# EAGLE design adapter (EAGLE 7.2.0)
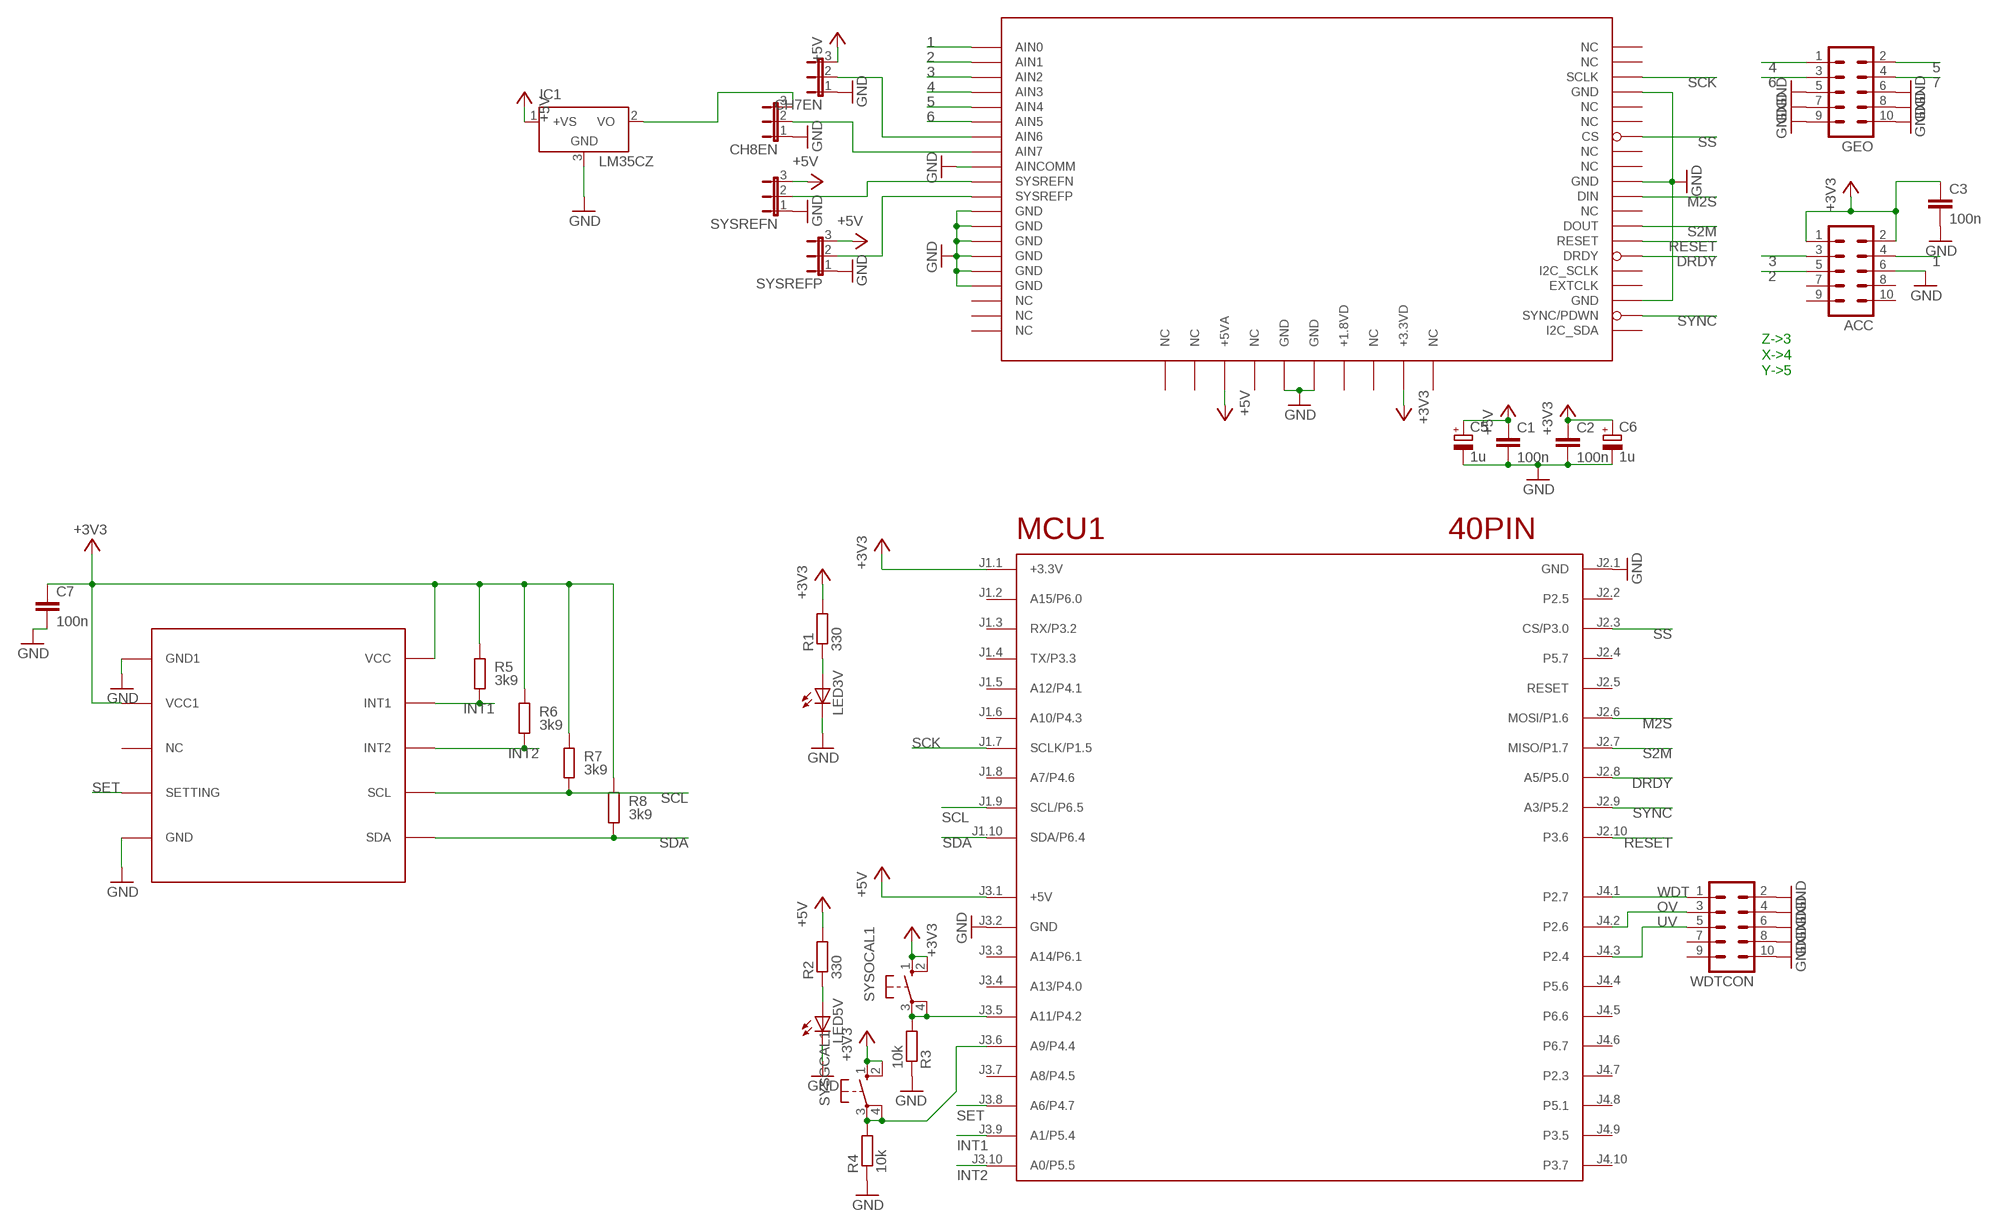
[diagram p0: schematic, sheet 1]

## Parts
ACC  ML10  [ML10]
C1  100n  C-EU050-025X075  [C050-025X075]
C2  100n  C-EU050-025X075  [C050-025X075]
C3  100n  C-EU050-025X075  [C050-025X075]
C5  1u  CPOL-EUE2,5-6E  [E2,5-6E]
C6  1u  CPOL-EUE2,5-6E  [E2,5-6E]
C7  100n  C-EU050-025X075  [C050-025X075]
CH7EN  JP2E  [JP2]
CH8EN  JP2E  [JP2]
GEO  ML10  [ML10]
IC1  LM35CZ  [TO92]
LED3V  LED3MM  [LED3MM]
LED5V  LED3MM  [LED3MM]
MCU1  40PIN  [40PIN]
R1  330  R-EU_0207/10  [0207/10]
R2  330  R-EU_0207/10  [0207/10]
R3  10k  R-EU_0207/10  [0207/10]
R4  10k  R-EU_0207/10  [0207/10]
R5  3k9  R-EU_0207/10  [0207/10]
R6  3k9  R-EU_0207/10  [0207/10]
R7  3k9  R-EU_0207/10  [0207/10]
R8  3k9  R-EU_0207/10  [0207/10]
SYSGCAL1  10-XX  [B3F-10XX]
SYSOCAL1  10-XX  [B3F-10XX]
SYSREFN  JP2E  [JP2]
SYSREFP  JP2E  [JP2]
U$1  D7S  [D7S]
U$2  ADS1256EVM  [ADS1256EVM]
WDTCON  ML10  [ML10]

## Nets
1: ACC.4 U$2.J1.1(AIN0)
2: ACC.5 U$2.J1.2(AIN1)
3: ACC.3 U$2.J1.3(AIN2)
4: GEO.1 U$2.J1.4(AIN3)
5: GEO.2 U$2.J1.5(AIN4)
6: GEO.3 U$2.J1.6(AIN5)
7: GEO.4
+3V3 [power]: ACC.1 ACC.2 C2.1 C3.1 C6.+ C7.1 MCU1.J1.1(+3.3V) R1.2 R5.2 R6.2 R7.2 R8.2 SYSGCAL1.1(S) SYSGCAL1.2(S1) SYSOCAL1.1(S) SYSOCAL1.2(S1) U$1.P$1(VCC) U$1.P$9(VCC1) U$2.J3.9(+3.3VD)
+5V [power]: C1.1 C5.+ CH7EN.3 IC1.1(+VS) MCU1.J3.1(+5V) R2.2 SYSREFN.3 SYSREFP.3 U$2.J3.3(+5VA)
DRDY: MCU1.J2.8(A5/P5.0) U$2.J2.15(DRDY)
GND [power]: ACC.6 C1.2 C2.2 C3.2 C5.- C6.- C7.2 CH7EN.1 CH8EN.1 GEO.5 GEO.6 GEO.7 GEO.8 GEO.9 GEO.10 IC1.3(GND) LED3V.K(C) LED5V.K(C) MCU1.J2.1(GND) MCU1.J3.2(GND) R3.1 R4.1 SYSREFN.1 SYSREFP.1 U$1.P$6(GND) U$1.P$10(GND1) U$2.J1.9(GND) U$2.J1.10(AINCOMM) U$2.J1.11(GND) U$2.J1.13(GND) U$2.J1.15(GND) U$2.J1.17(GND) U$2.J1.19(GND) U$2.J2.4(GND) U$2.J2.10(GND) U$2.J2.18(GND) U$2.J3.5(GND) U$2.J3.6(GND) WDTCON.2 WDTCON.4 WDTCON.6 WDTCON.8 WDTCON.10
INT1: MCU1.J3.9(A1/P5.4) R5.1 U$1.P$2(INT1)
INT2: MCU1.J3.10(A0/P5.5) R6.1 U$1.P$3(INT2)
M2S: MCU1.J2.6(MOSI/P1.6) U$2.J2.11(DIN)
N$1: LED3V.A R1.1
N$2: LED5V.A R2.1
N$3: CH8EN.3 IC1.2(VO)
N$4: CH8EN.2 U$2.J1.8(AIN7)
N$5: CH7EN.2 U$2.J1.7(AIN6)
N$7: MCU1.J3.5(A11/P4.2) R3.2 SYSOCAL1.3(P) SYSOCAL1.4(P1)
N$8: MCU1.J3.6(A9/P4.4) R4.2 SYSGCAL1.3(P) SYSGCAL1.4(P1)
N$22: SYSREFN.2 U$2.J1.18(SYSREFN)
N$23: SYSREFP.2 U$2.J1.20(SYSREFP)
OV: MCU1.J4.2(P2.6) WDTCON.3
RESET: MCU1.J2.10(P3.6) U$2.J2.14(RESET)
S2M: MCU1.J2.7(MISO/P1.7) U$2.J2.13(DOUT)
SCK: MCU1.J1.7(SCLK/P1.5) U$2.J2.3(SCLK)
SCL: MCU1.J1.9(SCL/P6.5) R7.1 U$1.P$4(SCL)
SDA: MCU1.J1.10(SDA/P6.4) R8.1 U$1.P$5(SDA)
SET: MCU1.J3.8(A6/P4.7) U$1.P$7(SETTING)
SS: MCU1.J2.3(CS/P3.0) U$2.J2.7(CS)
SYNC: MCU1.J2.9(A3/P5.2) U$2.J2.19(SYNC/PDWN)
UV: MCU1.J4.3(P2.4) WDTCON.5
WDT: MCU1.J4.1(P2.7) WDTCON.1
Unconnected: ACC.7 ACC.8 ACC.9 ACC.10 MCU1.J1.2(A15/P6.0) MCU1.J1.3(RX/P3.2) MCU1.J1.4(TX/P3.3) MCU1.J1.5(A12/P4.1) MCU1.J1.6(A10/P4.3) MCU1.J1.8(A7/P4.6) MCU1.J2.2(P2.5) MCU1.J2.4(P5.7) MCU1.J2.5(RESET) MCU1.J3.3(A14/P6.1) MCU1.J3.4(A13/P4.0) MCU1.J3.7(A8/P4.5) MCU1.J4.4(P5.6) MCU1.J4.5(P6.6) MCU1.J4.6(P6.7) MCU1.J4.7(P2.3) MCU1.J4.8(P5.1) MCU1.J4.9(P3.5) MCU1.J4.10(P3.7) U$1.P$8(NC) U$2.J1.12(NC) U$2.J1.14(NC) U$2.J1.16(NC) U$2.J2.1(NC) U$2.J2.2(NC) U$2.J2.5(NC) U$2.J2.6(NC) U$2.J2.8(NC) U$2.J2.9(NC) U$2.J2.12(NC) U$2.J2.16(I2C_SCLK) U$2.J2.17(EXTCLK) U$2.J2.20(I2C_SDA) U$2.J3.1(NC) U$2.J3.2(NC) U$2.J3.4(NC) U$2.J3.7(+1.8VD) U$2.J3.8(NC) U$2.J3.10(NC) WDTCON.7 WDTCON.9

## Notes on the sheet
- Z->3
  X->4
  Y->5

## Library data of the parts
ACC GEO WDTCON = con-ml:ML10: HARTING; OC_FARNELL: unknown; OC_NEWARK: unknown
C1-C3 C7 = rcl:C-EU: CAPACITOR, European symbol
C5 C6 = rcl:CPOL-EU: POLARIZED CAPACITOR, European symbol
CH7EN CH8EN SYSREFN SYSREFP = jumper:JP2E: JUMPER
IC1 = lm35:LM35: Single-Supply Centigrade Temperature Sensor Vout = (10mV/°C x Temp °C) +5mmmV Source: http://www.national.com/ds/LM/LM35.pdf
LED3V LED5V = led:LED: LED OSRAM: - CHIPLED LG R971, LG N971, LY N971, LG Q971, LY Q971, LO R971, LY R971 LH N974, LH R974 LS Q976, LO Q976, LY Q976 LO Q996 - Hyper CHIPLED LW Q18S LB Q993, LB Q99A, LB R99A - SideLED LS A670, LO A670, LY A670, LG A670, LP A670 LB A673, LV A673, LT A673, LW A673 LH A674 LY A675 LS A676, LA A676, LO A676, LY A676, LW A676 LS A679, LY A679, LG A679 - Hyper Micro SIDELED® LS Y876, LA Y876, LO Y876, LY Y876 LT Y87S - SmartLED LW L88C, LW L88S LB L89C, LB L89S, LG L890 LS L89K, LO L89K, LY L89K LS L896, LA L896, LO L896, LY L896 - TOPLED LS T670, LO T670, LY T670, LG T670, LP T670 LSG T670, LSP T670, LSY T670, LOP T670, LYG T670 LG T671, LOG T671, LSG T671 LB T673, LV T673, LT T673, LW T673 LH T674 LS T676, LA T676, LO T676, LY T676, LB T676, LH T676, LSB T676, LW T676 LB T67C, LV T67C, LT T67C, LS T67K, LO T67K, LY T67K, LW E67C LS E67B, LA E67B, LO E67B, LY E67B, LB E67C, LV E67C, LT E67C LW T67C LS T679, LY T679, LG T679 LS T770, LO T770, LY T770, LG T770, LP T770 LB T773, LV T773, LT T773, LW T773 LH T774 LS E675, LA E675, LY E675, LS T675 LS T776, LA T776, LO T776, LY T776, LB T776 LHGB T686 LT T68C, LB T68C - Hyper Mini TOPLED® LB M676 - Mini TOPLED Santana® LG M470 LS M47K, LO M47K, LY M47K Source: http://www.osram.convergy.de LUXEON: - LUMILED® LXK2-PW12-R00, LXK2-PW12-S00, LXK2-PW14-U00, LXK2-PW14-V00 LXK2-PM12-R00, LXK2-PM12-S00, LXK2-PM14-U00 LXK2-PE12-Q00, LXK2-PE12-R00, LXK2-PE12-S00, LXK2-PE14-T00, LXK2-PE14-U00 LXK2-PB12-K00, LXK2-PB12-L00, LXK2-PB12-M00, LXK2-PB14-N00, LXK2-PB14-P00, LXK2-PB14-Q00 LXK2-PR12-L00, LXK2-PR12-M00, LXK2-PR14-Q00, LXK2-PR14-R00 LXK2-PD12-Q00, LXK2-PD12-R00, LXK2-PD12-S00 LXK2-PH12-R00, LXK2-PH12-S00 LXK2-PL12-P00, LXK2-PL12-Q00, LXK2-PL12-R00 Source: www.luxeon.com KINGBRIGHT: KA-3528ASYC Source: www.kingbright.com
MCU1 = msp432Launchpad:40PIN
R1-R4 = rcl:R-EU_: RESISTOR, European symbol
R5-R8 = resistor:R-EU_: RESISTOR, European symbol; TOLERANCE: 5%
SYSGCAL1 SYSOCAL1 = switch-omron:10-XX: OMRON SWITCH; MPN: B3F-1000; OC_FARNELL: 176432; OC_NEWARK: 36M3542
U$1 = e14_Rpi3_RevA:D7S
U$2 = TIStellarisLaunchpad:ADS1256EVM

## Net classes
1 power: width 0.406 mm, clearance 0.203 mm

## Board
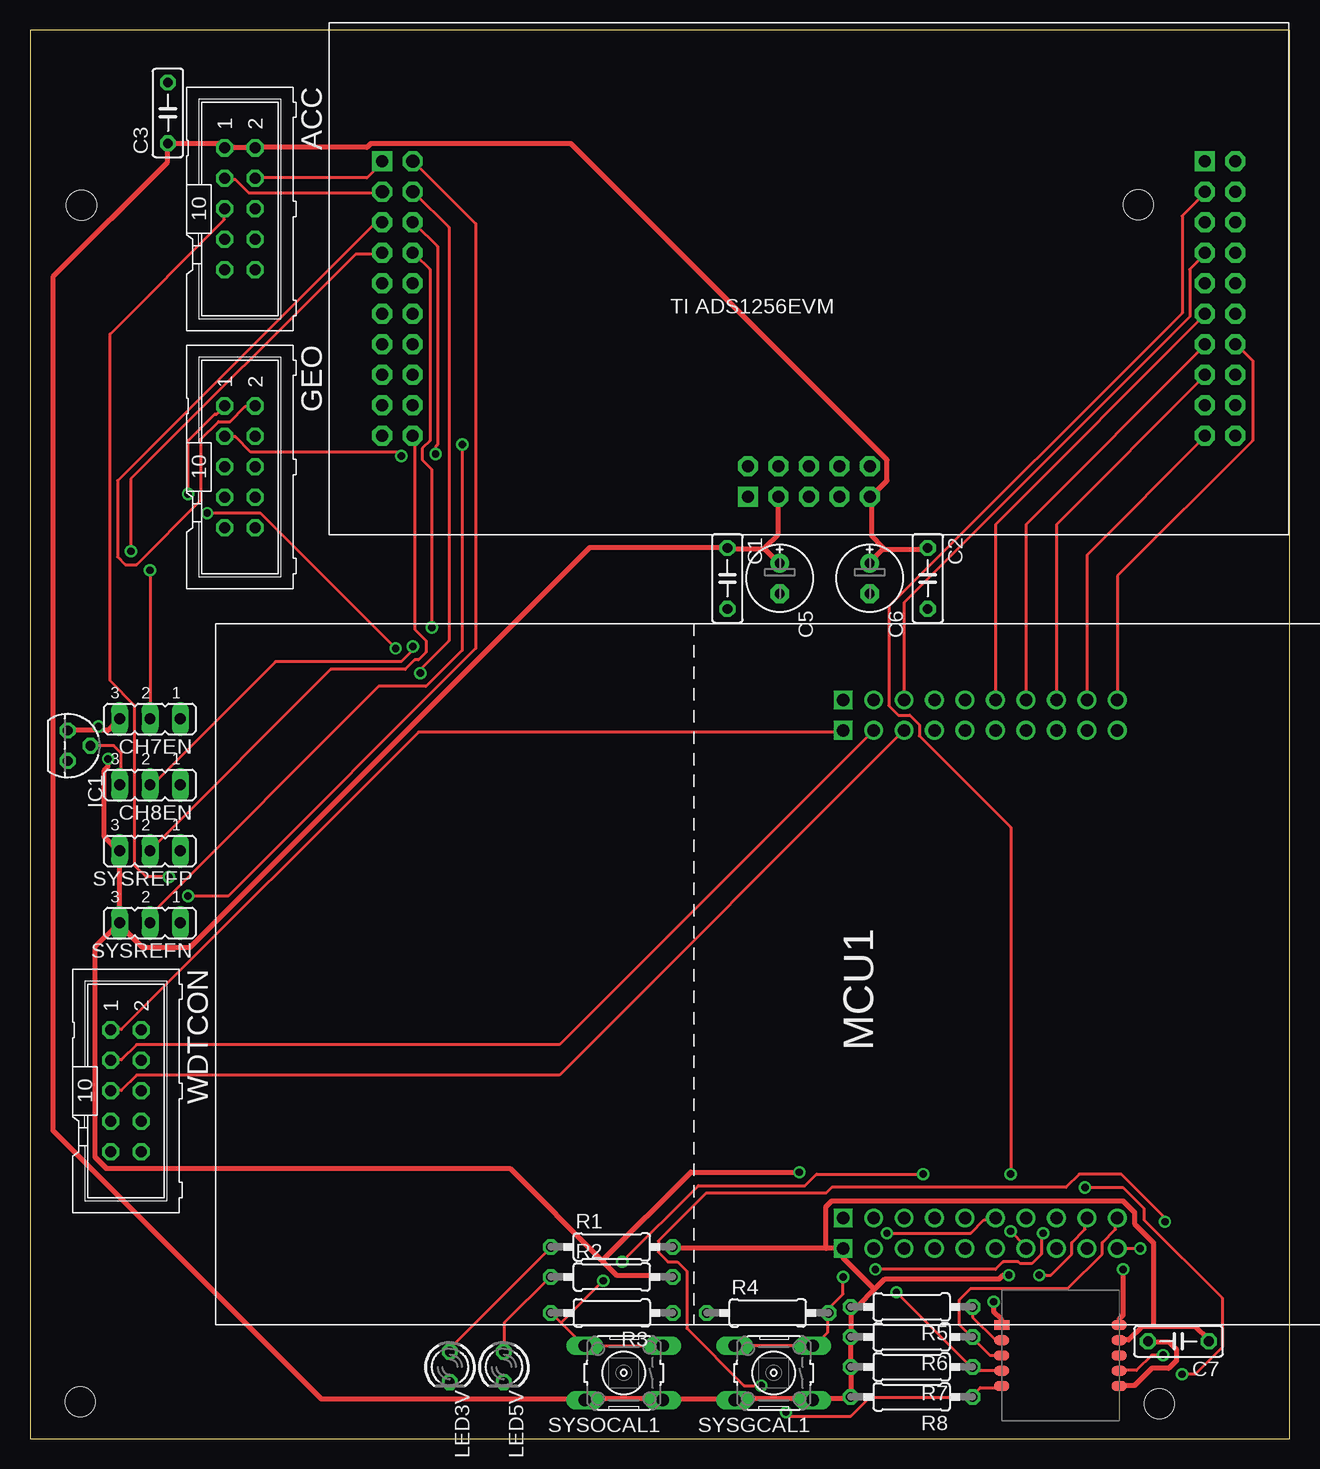
[diagram p1: board, top side]
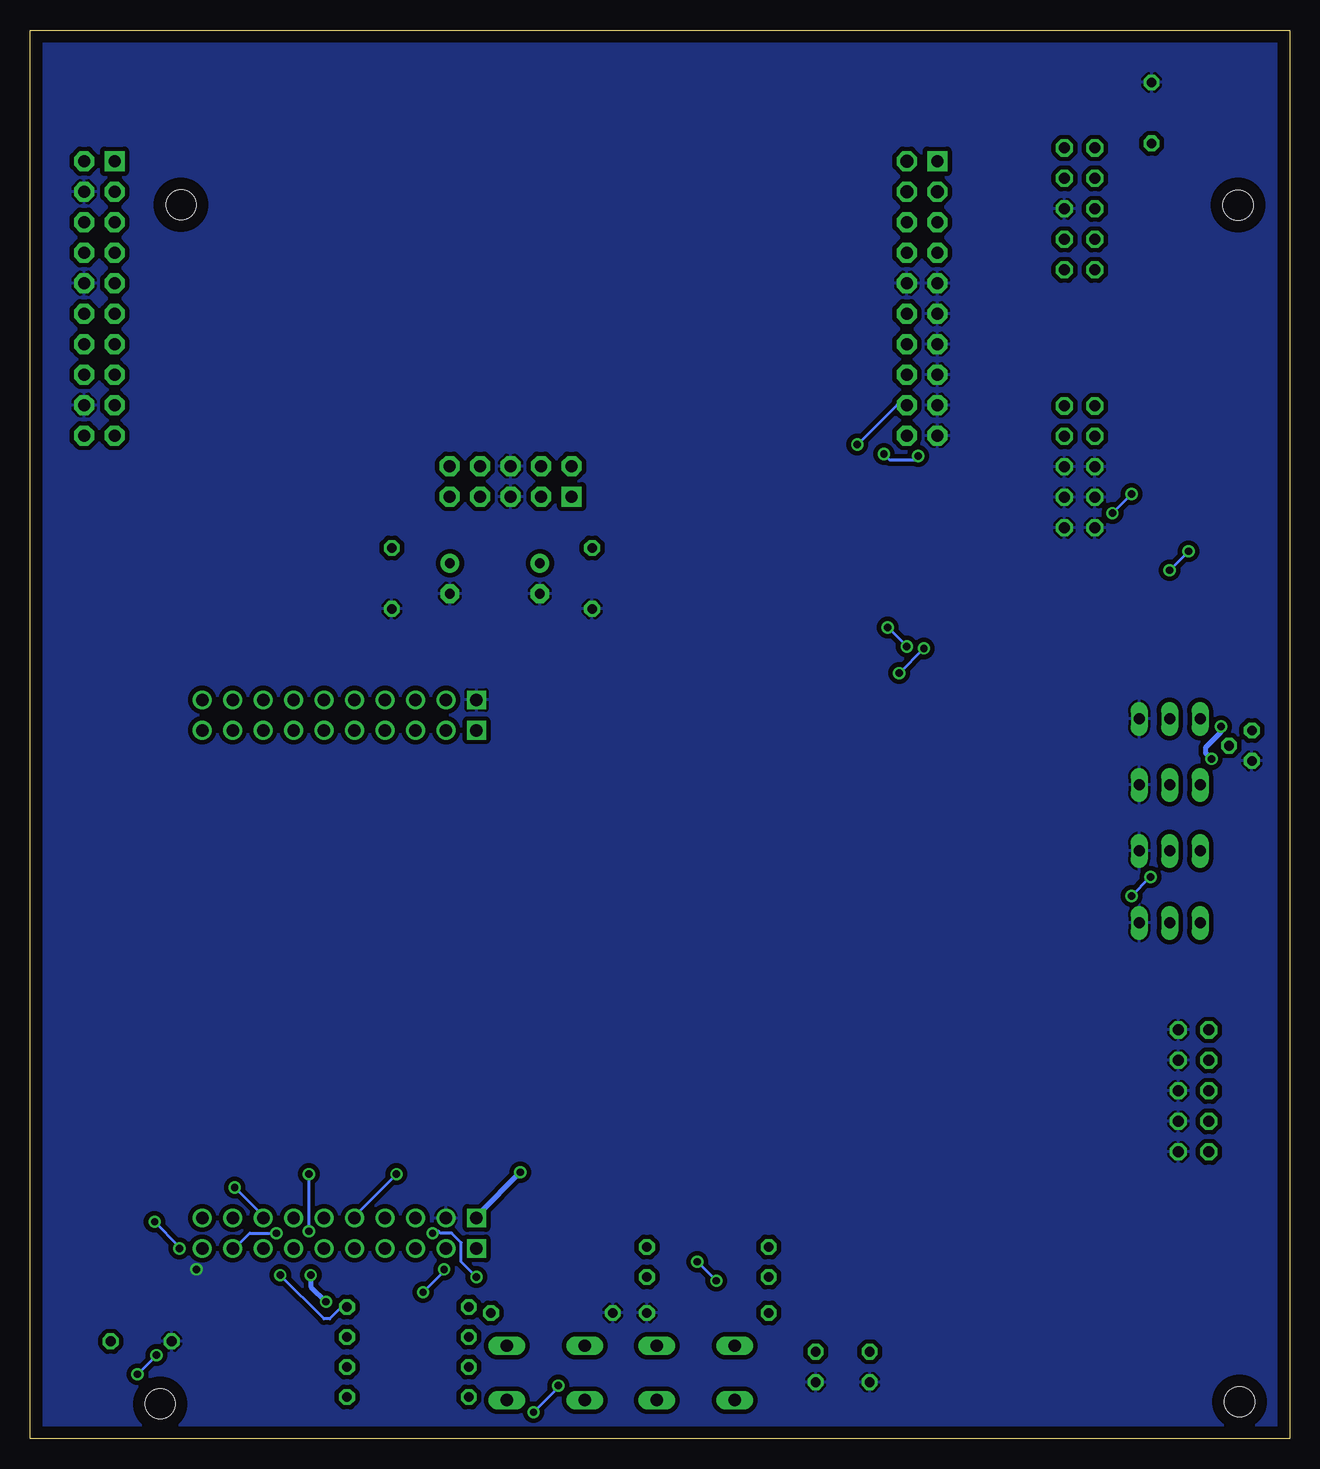
[diagram p2: board, bottom side, seen from below]

Size 105 x 117.41 mm. Coordinates in mm from the lower left corner, seen from the top.
Outline: 0,0 105,0 105,117.41 0,117.41 0,0
Copper layers (1*16): Top 0.035mm / dielectric 1.5mm / Bottom 0.035mm
Design rules "default *": minimum track width 10mil, minimum drill 24mil, track to track 15mil, track to pad 12mil, pad to pad 12mil, via to via 15mil, smd to smd 8mil, copper to edge 40mil, drill to drill 8mil, minimum pad ring 10mil, minimum via ring 8mil, stop-mask expansion 4mil, vias tented up to drill 0mil, thermal gap 8mil
Holes 2.5 mm at 4.18,3.1 92.41,102.84 94.15,2.92 4.29,102.82

### Footprints (pad centres in the part's own frame; a part is rotated, then mirrored left to right if it is on the bottom)
ML10 = drill 0.914 octagon: 1 -5.08,-1.27; 2 -5.08,1.27; 3 -2.54,-1.27; 4 -2.54,1.27; 5 0,-1.27; 6 0,1.27; 7 2.54,-1.27; 8 2.54,1.27; 9 5.08,-1.27; 10 5.08,1.27
C050-025X075 = drill 0.813 octagon: 1 -2.54,0; 2 2.54,0
E2,5-6E = drill 0.813 pad 1.575: + -1.27,0 | drill 0.813 pad 1.575 octagon: - 1.27,0
JP2 = drill 0.914 long: 1 -2.54,0; 2 0,0; 3 2.54,0
TO92 = drill 0.813 octagon: 1 -1.27,0; 2 0,1.905; 3 1.27,0
LED3MM = drill 0.813 octagon: A -1.27,0; K 1.27,0
40PIN = drill 1.041 square: J1.1 -10.16,-22.86; J2.1 -10.16,22.86; J3.1 -10.16,-20.32; J4.1 -10.16,20.32 | drill 1.041: J1.2 -7.62,-22.86; J1.3 -5.08,-22.86; J1.4 -2.54,-22.86; J1.5 0,-22.86; J1.6 2.54,-22.86; J1.7 5.08,-22.86; J1.8 7.62,-22.86; J1.9 10.16,-22.86; J1.10 12.7,-22.86; J2.2 -7.62,22.86; J2.3 -5.08,22.86; J2.4 -2.54,22.86; J2.5 0,22.86; J2.6 2.54,22.86; J2.7 5.08,22.86; J2.8 7.62,22.86; J2.9 10.16,22.86; J2.10 12.7,22.86; J3.2 -7.62,-20.32; J3.3 -5.08,-20.32; J3.4 -2.54,-20.32; J3.5 0,-20.32; J3.6 2.54,-20.32; J3.7 5.08,-20.32; J3.8 7.62,-20.32; J3.9 10.16,-20.32; J3.10 12.7,-20.32; J4.2 -7.62,20.32; J4.3 -5.08,20.32; J4.4 -2.54,20.32; J4.5 0,20.32; J4.6 2.54,20.32; J4.7 5.08,20.32; J4.8 7.62,20.32; J4.9 10.16,20.32; J4.10 12.7,20.32
0207/10 = drill 0.813 octagon: 1 -5.08,0; 2 5.08,0
B3F-10XX = drill 1.016 long: 1 -3.251,2.261; 2 3.251,2.261; 3 -3.251,-2.261; 4 3.251,-2.261
D7S = smd 1.25 x 0.8: P$1 0,7.99; P$2 0,6.72; P$3 0,5.45; P$4 0,4.18; P$5 0,2.91; P$6 9.8,2.91; P$7 9.8,4.18; P$8 9.8,5.45; P$9 9.8,6.72; P$10 9.8,7.99
ADS1256EVM = drill 1 pad 1.676 square: J1.1 -24.13,13.97; J2.1 44.45,13.97; J3.1 6.35,-13.97 | drill 1.1 pad 1.676 octagon: J1.2 -21.59,13.97; J1.3 -24.13,11.43; J1.4 -21.59,11.43 | drill 1 pad 1.676 octagon: J1.5 -24.13,8.89; J1.6 -21.59,8.89; J1.7 -24.13,6.35; J1.8 -21.59,6.35; J1.9 -24.13,3.81; J1.10 -21.59,3.81; J1.11 -24.13,1.27; J1.12 -21.59,1.27; J1.13 -24.13,-1.27; J1.14 -21.59,-1.27; J1.15 -24.13,-3.81; J1.16 -21.59,-3.81; J1.17 -24.13,-6.35; J1.18 -21.59,-6.35; J1.19 -24.13,-8.89; J1.20 -21.59,-8.89; J2.2 46.99,13.97; J2.3 44.45,11.43; J2.4 46.99,11.43; J2.5 44.45,8.89; J2.6 46.99,8.89; J2.7 44.45,6.35; J2.8 46.99,6.35; J2.9 44.45,3.81; J2.10 46.99,3.81; J2.11 44.45,1.27; J2.12 46.99,1.27; J2.13 44.45,-1.27; J2.14 46.99,-1.27; J2.15 44.45,-3.81; J2.16 46.99,-3.81; J2.17 44.45,-6.35; J2.18 46.99,-6.35; J2.19 44.45,-8.89; J2.20 46.99,-8.89; J3.2 6.35,-11.43; J3.3 8.89,-13.97; J3.4 8.89,-11.43; J3.5 11.43,-13.97; J3.6 11.43,-11.43; J3.7 13.97,-13.97; J3.8 13.97,-11.43; J3.9 16.51,-13.97; J3.10 16.51,-11.43

### Placement (x,y rotation side)
ACC  17.5,102.5 270 top
C1  58.14,71.71 270 top
C2  74.84,71.71 270 top
C3  11.5,110.5 90 top
C5  62.5,71.71 270 top
C6  70,71.71 270 top
C7  95.74,8.13 180 top
CH7EN  10,60 180 top
CH8EN  10,54.5 180 top
GEO  17.5,81 270 top
IC1  3.14,57.77 270 top
LED3V  35,6 270 top
LED5V  39.5,6 270 top
MCU1  77.94,38.73 0 top
R1  48.5,16 0 top
R2  48.5,13.5 0 top
R3  48.5,10.5 180 top
R4  61.5,10.5 0 top
R5  73.5,11 180 top
R6  73.5,8.5 180 top
R7  73.5,6 180 top
R8  73.5,3.5 180 top
SYSGCAL1  62,5.5 180 top
SYSOCAL1  49.5,5.5 180 top
SYSREFN  10,43 180 top
SYSREFP  10,49 180 top
U$1  81,1.5 0 top
U$2  53.5,92.5 0 top
WDTCON  8,29 270 top

### Tracks (layer width: path | path; a pad name or v marks a point on that pad's centre or on a via)
1
  Top 0.254: ACC.4 18.89,105.09 28.1,105.09 29.37,106.36 U$2.J1.1
2  (via drill 0.61)
  Top 0.254: v11.59,46.83 9.68,46.83 8.73,47.78 8.73,61.12 6.67,63.18 6.67,92.08 16.19,101.6 16.19,102.39 ACC.5 | v13.18,45.24 16.51,45.24 37.15,65.88 37.15,101.28 32.07,106.36 U$2.J1.2
  Bottom 0.254: v13.18,45.24 v11.59,46.83
3
  Top 0.254: ACC.3 16.35,104.93 17.14,104.93 18.26,103.82 29.37,103.82 U$2.J1.3
4  (via drill 0.61)
  Top 0.254: GEO.1 15.56,85.41 15.4,85.41 13.18,83.19 v13.18,78.74 | v14.76,77.15 19.21,77.15 v30.48,65.88 | v32.54,63.82 32.54,64.14 34.92,66.52 34.92,100.97 32.07,103.82 U$2.J1.4
  Bottom 0.254: v14.76,77.15 v13.18,78.74 | v32.54,63.82 v30.48,65.88
5
  Top 0.254: GEO.2 18.73,86.04 17.94,86.04 16.67,84.77 15.72,84.77 14.29,83.34 14.29,78.26 8.89,72.87 7.94,72.87 7.3,73.5 7.3,79.85 28.73,101.28 29.37,101.28 U$2.J1.5
6  (via drill 0.61)
  Top 0.254: v30.96,81.92 30.64,82.23 18.41,82.23 17.14,83.5 16.35,83.5 GEO.3 | v33.81,82.07 33.81,82.71 33.97,82.87 33.97,99.38 32.07,101.28 U$2.J1.6
  Bottom 0.254: v30.96,81.92 31.27,81.6 33.34,81.6 v33.81,82.07
+3V3  (via drill 0.61)
  Top 0.406: v80.33,11.43 80.33,10.64 80.96,10 80.96,9.53 U$1.P$1 | v81.6,13.65 81.12,13.65 80.8,13.34 71.28,13.34 70.41,12.46 | 70.41,12.46 69.06,11.11 68.42,11.11 R5.2 68.42,10.95 68.42,8.57 R6.2 68.42,8.41 68.42,6.19 R7.2 68.42,5.87 68.42,3.65 R8.2 68.42,3.33 65.41,3.33 SYSGCAL1.1 65.09,3.33 58.9,3.33 SYSGCAL1.2 58.74,3.33 52.86,3.33 SYSOCAL1.1 52.7,3.33 46.35,3.33 SYSOCAL1.2 46.2,3.33 24.29,3.33 1.91,25.72 1.91,96.84 11.43,106.36 11.43,107.79 C3.1 11.59,107.95 15.88,107.95 16.19,107.63 ACC.1 16.35,107.63 18.73,107.63 ACC.2 18.89,107.63 28.1,107.63 28.42,107.95 45.09,107.95 71.44,81.6 71.44,79.85 70.17,78.58 U$2.J3.9 70.17,78.42 70.17,75.25 71.12,74.3 71.12,74.14 | 93.66,9.37 97.16,9.37 98.27,8.26 C7.1 | 93.66,9.37 92.71,9.37 91.6,8.26 90.81,8.26 U$1.P$9 | 66.36,15.88 67.63,15.88 MCU1.J1.1 67.79,15.72 67.79,15.08 70.41,12.46 | 66.36,15.88 53.66,15.88 R1.2 | 93.66,9.37 93.66,16.35 92.08,17.94 92.08,18.89 91.12,19.84 66.83,19.84 66.36,19.37 66.36,15.88 | 71.12,74.14 74.77,74.14 C2.1 | 71.12,74.14 70.01,73.03 C6.+
  Bottom 0.406: v80.33,11.43 81.6,12.7 v81.6,13.65
+5V  (via drill 0.61)
  Top 0.406: 61.28,74.14 58.26,74.14 C1.1 57.94,74.3 46.67,74.3 13.34,40.96 9.37,40.96 7.46,42.86 SYSREFN.3 | 61.28,74.14 62.39,73.03 C5.+ | U$2.J3.3 62.39,78.42 62.39,75.41 61.28,74.3 61.28,74.14 | 5.71,59.05 6.51,59.05 7.3,59.85 CH7EN.3 | 5.71,59.05 3.17,59.05 IC1.1 | 47.7,14.84 40.01,22.54 6.35,22.54 5.4,23.5 5.4,40.96 7.3,42.86 SYSREFN.3 | 47.7,14.84 48.9,13.65 53.5,13.65 R2.2 | SYSREFN.3 7.46,43.18 7.46,48.9 SYSREFP.3 7.3,49.05 6.19,50.16 6.19,55.72 6.51,56.04 v6.51,56.67 | v64.14,22.23 55.09,22.23 47.7,14.84 | v5.71,59.37 5.71,59.05
  Bottom 0.406: v64.14,22.23 67.63,18.73 67.63,18.41 MCU1.J3.1 | v5.71,59.37 5.71,58.9 6.99,57.63 6.99,57.15 v6.51,56.67
DRDY
  Top 0.254: MCU1.J2.8 85.57,76.2 97.95,88.58 U$2.J2.15
GND  (via drill 0.61)
  Top 0.406: U$1.P$6 90.81,4.45 92.08,4.45 93.5,5.87 94.93,5.87 95.57,6.51 95.57,7.46 94.93,8.1 93.34,8.1 C7.2 | v91.12,14.13 91.12,10.32 90.81,10 90.81,9.53 U$1.P$10
  pour Bottom (isolate 0.305): -0.64,118.11 117.4,117.4 117.4,-0.64 -0.64,-0.64
INT1  (via drill 0.61)
  Top 0.254: U$1.P$2 80.96,8.26 80.49,8.26 78.58,10.16 78.58,10.95 R5.1 | v84.14,13.65 85.09,13.65 86.84,15.4 86.84,16.35 87.95,17.46 87.95,18.26 MCU1.J3.9
  Bottom 0.254: v84.14,13.65 80.49,10 80.01,10 79.06,10.95 78.58,10.95 R5.1
INT2
  Top 0.254: U$1.P$3 80.96,6.99 80.01,6.99 78.58,8.41 R6.1 78.42,8.57 77.47,9.53 77.47,11.59 78.42,12.54 86.52,12.54 89.38,15.4 89.38,16.35 90.49,17.46 90.49,18.26 MCU1.J3.10
M2S
  Top 0.254: MCU1.J2.6 80.49,76.2 97.95,93.66 U$2.J2.11
N$1
  Top 0.254: LED3V.A 35.08,7.3 35.08,7.62 43.34,15.88 R1.1
N$2
  Top 0.254: LED5V.A 39.53,7.3 39.53,9.68 43.34,13.49 R2.1
N$3
  Top 0.254: IC1.2 5.08,57.78 6.99,57.78 7.62,57.15 7.62,54.77 7.46,54.61 CH8EN.3
N$4  (via drill 0.61)
  Top 0.254: v31.91,66.04 31.91,65.72 30.96,64.77 20.48,64.77 10.32,54.61 10,54.61 CH8EN.2 | v33.5,67.63 33.5,80.8 32.7,81.6 32.7,82.55 33.34,83.19 33.34,97.47 32.07,98.74 U$2.J1.8
  Bottom 0.254: v33.5,67.63 v31.91,66.04
N$5  (via drill 0.61)
  Top 0.254: v10,72.39 CH7EN.2 | v8.41,73.98 8.41,80.01 27.15,98.74 29.37,98.74 U$2.J1.7
  Bottom 0.254: v8.41,73.98 v10,72.39
N$7  (via drill 0.61)
  Top 0.254: 44.29,9.68 46.2,7.78 SYSOCAL1.4 46.35,7.78 52.7,7.78 SYSOCAL1.3 | 44.29,9.68 43.5,10.48 R3.2 | v74.45,22.07 65.56,22.07 64.61,21.11 55.72,21.11 v49.37,14.76 | 44.29,9.68 v47.78,13.18
  Bottom 0.254: v74.45,22.07 77.79,18.73 77.79,18.41 MCU1.J3.5 | v47.78,13.18 v49.37,14.76
N$8  (via drill 0.61)
  Top 0.254: SYSGCAL1.4 58.9,7.78 65.25,7.78 SYSGCAL1.3 65.41,7.78 66.52,8.89 66.52,10.48 R4.2 66.67,10.64 66.67,10.95 67.79,12.06 v67.79,13.49 | v71.44,17.14 78.42,17.14 79.53,18.26 80.33,18.26 MCU1.J3.6
  Bottom 0.254: v71.44,17.14 71.28,17.3 70.96,17.3 70.8,17.14 69.85,17.14 69.06,16.35 69.06,14.76 v67.79,13.49
N$22  (via drill 0.61)
  Top 0.254: v36.04,82.87 36.04,65.72 33.02,62.71 29.05,62.71 10,43.66 10,43.02 SYSREFN.2
  Bottom 0.254: v36.04,82.87 32.7,86.2 32.07,86.2 U$2.J1.18
N$23
  Top 0.254: SYSREFP.2 10,49.05 25.08,64.14 31.27,64.14 32.07,64.93 32.38,64.93 33.02,65.56 33.02,66.52 32.07,67.47 32.07,83.5 U$2.J1.20
OV
  Top 0.254: WDTCON.3 6.83,31.59 7.62,31.59 8.89,32.86 44.13,32.86 70.17,58.9 MCU1.J4.2
RESET
  Top 0.254: MCU1.J2.10 90.65,71.91 101.92,83.19 101.92,89.85 100.65,91.12 U$2.J2.14
S2M
  Top 0.254: MCU1.J2.7 83.03,76.2 97.95,91.12 U$2.J2.13
SCK  (via drill 0.61)
  Top 0.254: v81.76,17.3 82.87,16.19 82.87,15.88 MCU1.J1.7 | v81.76,22.07 81.76,50.96 74.14,58.58 74.14,59.53 73.34,60.33 72.39,60.33 71.6,61.12 71.6,69.37 96.04,93.82 96.04,101.92 97.95,103.82 U$2.J2.3
  Bottom 0.254: v81.76,22.07 v81.76,17.3
SCL  (via drill 0.61)
  Top 0.254: U$1.P$4 80.96,5.71 78.74,5.71 78.58,5.87 R7.1 78.42,6.03 v72.23,12.22 | v70.48,14.13 80.49,14.13 81.12,14.76 82.39,14.76 82.55,14.61 83.5,14.61 84.3,15.4 84.3,16.99 v84.45,17.14
  Bottom 0.254: v72.23,12.22 70.48,13.97 v70.48,14.13 | v84.45,17.14 86.68,17.14 87.95,15.88 MCU1.J1.9
SDA  (via drill 0.61)
  Top 0.254: U$1.P$5 80.96,4.29 79.22,4.29 78.58,3.65 R8.1 78.42,3.49 70.01,3.49 68.42,1.91 63.34,1.91 v63.02,2.22 | v60.96,4.45 59.53,4.45 54.77,9.21 54.77,13.97 53.98,14.76 53.18,14.76 52.39,15.56 52.39,16.51 56.36,20.48 66.36,20.48 66.83,20.95 86.36,20.95 87.47,22.07 90.96,22.07 94.61,18.41 v94.61,18.1 | v92.55,15.88 MCU1.J1.10
  Bottom 0.254: v63.02,2.22 61.28,3.97 61.28,4.13 v60.96,4.45 | v94.61,18.1 92.55,16.03 v92.55,15.88
SET  (via drill 0.61)
  Top 0.254: v94.46,6.99 93.5,6.99 92.23,5.71 90.81,5.71 U$1.P$7 | v96.04,5.4 97.16,5.4 99.38,7.62 99.38,11.75 92.87,18.26 92.87,19.21 91.12,20.95 v87.95,20.95
  Bottom 0.254: v96.04,5.4 v94.46,6.99 | v87.95,20.95 85.41,18.41 MCU1.J3.8
SS
  Top 0.254: MCU1.J2.3 72.87,69.69 96.68,93.5 96.68,97.47 97.95,98.74 U$2.J2.7
SYNC
  Top 0.254: MCU1.J2.9 88.11,73.66 97.95,83.5 U$2.J2.19
UV
  Top 0.254: WDTCON.5 6.83,29.05 7.62,29.05 8.89,30.32 44.13,30.32 72.71,58.9 MCU1.J4.3
WDT
  Top 0.254: WDTCON.1 6.83,34.13 7.62,34.13 32.38,58.9 67.63,58.9 MCU1.J4.1